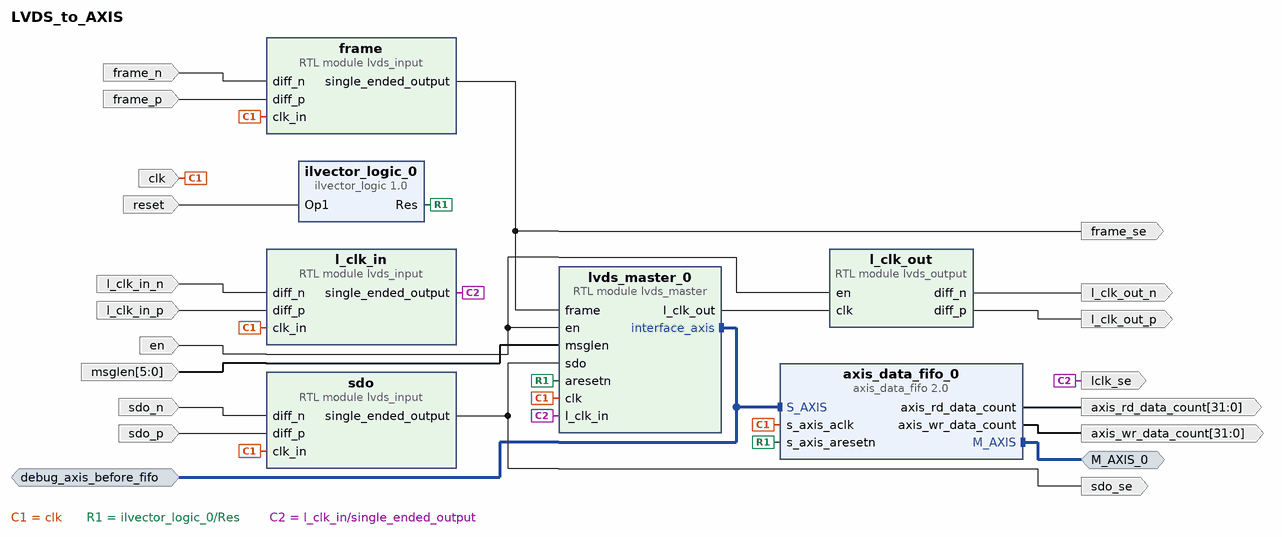
[diagram p0: block diagram of the top level]
# Vivado block design LVDS_to_AXIS, xc7z020clg484-1, Vivado 2024.2
create_bd_design LVDS_to_AXIS

create_bd_intf_port -mode Master -vlnv xilinx.com:interface:axis_rtl:1.0 M_AXIS_0
create_bd_intf_port -mode Monitor -vlnv xilinx.com:interface:axis_rtl:1.0 debug_axis_before_fifo
set_property -dict {CONFIG.CLK_DOMAIN LVDS_to_AXIS_clk_0} [get_bd_intf_ports debug_axis_before_fifo]
create_bd_port -dir I -type clk clk
set_property -dict {CONFIG.ASSOCIATED_BUSIF M_AXIS_0:debug_axis_before_fifo CONFIG.ASSOCIATED_RESET reset} [get_bd_ports clk]
create_bd_port -dir I en
create_bd_port -dir I -type rst reset
set_property -dict {CONFIG.POLARITY ACTIVE_HIGH} [get_bd_ports reset]
create_bd_port -dir I frame_p
create_bd_port -dir I frame_n
create_bd_port -dir I sdo_p
create_bd_port -dir I sdo_n
create_bd_port -dir I l_clk_in_p
create_bd_port -dir I l_clk_in_n
create_bd_port -dir I -from 5 -to 0 msglen
create_bd_port -dir O l_clk_out_n
create_bd_port -dir O l_clk_out_p
create_bd_port -dir O lclk_se
create_bd_port -dir O frame_se
create_bd_port -dir O sdo_se
create_bd_port -dir O -from 31 -to 0 axis_wr_data_count
create_bd_port -dir O -from 31 -to 0 axis_rd_data_count

create_bd_cell -type ip -vlnv xilinx.com:ip:axis_data_fifo:2.0 axis_data_fifo_0
set_property -dict [list \
  CONFIG.HAS_PROG_EMPTY 0 \
  CONFIG.HAS_RD_DATA_COUNT 1 \
  CONFIG.HAS_WR_DATA_COUNT 1 \
  CONFIG.TDATA_NUM_BYTES 8 \
] [get_bd_cells axis_data_fifo_0]
create_bd_cell -type module -reference lvds_master lvds_master_0
create_bd_cell -type module -reference lvds_output l_clk_out
create_bd_cell -type module -reference lvds_input l_clk_in
create_bd_cell -type module -reference lvds_input sdo
create_bd_cell -type module -reference lvds_input frame
create_bd_cell -type inline_hdl -vlnv xilinx.com:inline_hdl:ilvector_logic:1.0 ilvector_logic_0
set_property -dict {CONFIG.C_OPERATION not} [get_bd_cells ilvector_logic_0]

# ---- connections ----

connect_bd_intf_net [get_bd_intf_ports M_AXIS_0] [get_bd_intf_pins axis_data_fifo_0/M_AXIS]
connect_bd_intf_net [get_bd_intf_pins lvds_master_0/interface_axis] [get_bd_intf_pins axis_data_fifo_0/S_AXIS]
connect_bd_intf_net [get_bd_intf_pins lvds_master_0/interface_axis] [get_bd_intf_ports debug_axis_before_fifo]
connect_bd_net [get_bd_pins axis_data_fifo_0/axis_rd_data_count] [get_bd_ports axis_rd_data_count]
connect_bd_net [get_bd_pins axis_data_fifo_0/axis_wr_data_count] [get_bd_ports axis_wr_data_count]
connect_bd_net -net clk_0_1 [get_bd_ports clk] \
  [get_bd_pins axis_data_fifo_0/s_axis_aclk] [get_bd_pins sdo/clk_in] [get_bd_pins l_clk_in/clk_in] \
  [get_bd_pins frame/clk_in] [get_bd_pins lvds_master_0/clk]
connect_bd_net -net en_0_1 [get_bd_ports en] [get_bd_pins l_clk_out/en] [get_bd_pins lvds_master_0/en]
connect_bd_net -net frame_n_0_1 [get_bd_ports frame_n] [get_bd_pins frame/diff_n]
connect_bd_net -net frame_p_0_1 [get_bd_ports frame_p] [get_bd_pins frame/diff_p]
connect_bd_net [get_bd_pins frame/single_ended_output] [get_bd_ports frame_se] [get_bd_pins lvds_master_0/frame]
connect_bd_net [get_bd_pins ilvector_logic_0/Res] [get_bd_pins axis_data_fifo_0/s_axis_aresetn] [get_bd_pins lvds_master_0/aresetn]
connect_bd_net -net l_clk_in_lvds_output [get_bd_pins l_clk_in/single_ended_output] [get_bd_ports lclk_se] [get_bd_pins lvds_master_0/l_clk_in]
connect_bd_net -net l_clk_in_n_0_1 [get_bd_ports l_clk_in_n] [get_bd_pins l_clk_in/diff_n]
connect_bd_net -net l_clk_in_p_0_1 [get_bd_ports l_clk_in_p] [get_bd_pins l_clk_in/diff_p]
connect_bd_net [get_bd_pins lvds_master_0/l_clk_out] [get_bd_pins l_clk_out/clk]
connect_bd_net -net lvds_output_0_l_clk_out_n [get_bd_pins l_clk_out/diff_n] [get_bd_ports l_clk_out_n]
connect_bd_net -net lvds_output_0_l_clk_out_p [get_bd_pins l_clk_out/diff_p] [get_bd_ports l_clk_out_p]
connect_bd_net -net msglen_0_1 [get_bd_ports msglen] [get_bd_pins lvds_master_0/msglen]
connect_bd_net [get_bd_ports reset] [get_bd_pins ilvector_logic_0/Op1]
connect_bd_net -net sdo_n_0_1 [get_bd_ports sdo_n] [get_bd_pins sdo/diff_n]
connect_bd_net -net sdo_p_0_1 [get_bd_ports sdo_p] [get_bd_pins sdo/diff_p]
connect_bd_net [get_bd_pins sdo/single_ended_output] [get_bd_ports sdo_se] [get_bd_pins lvds_master_0/sdo]

validate_bd_design
save_bd_design
